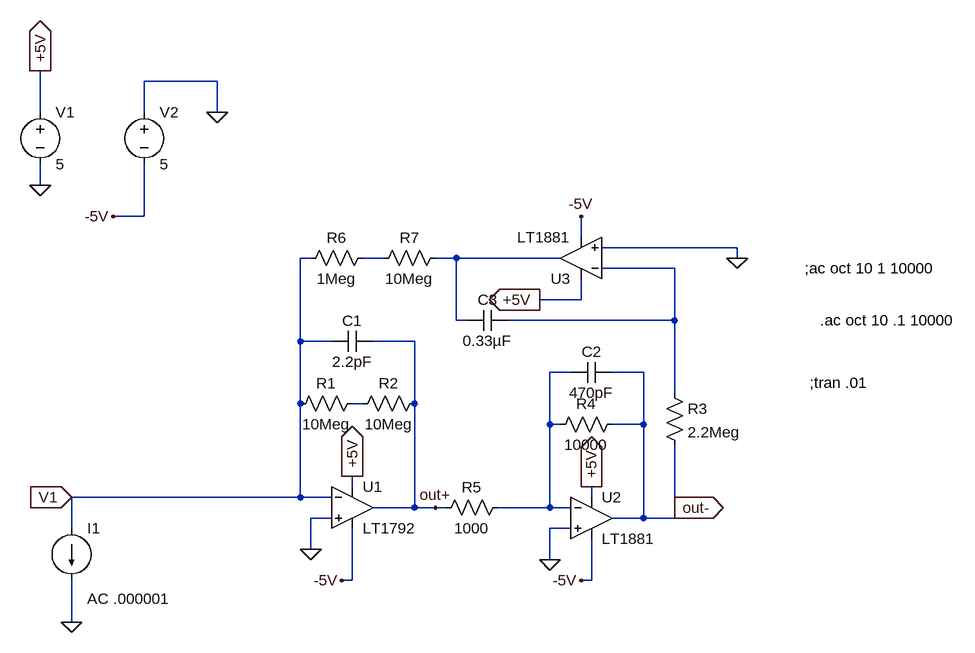
[diagram p0: schematic TRANSIMPDANCE AMPLIFIER WITH 60HZ SERVO REJECTION CIRCUIT.asc]
TRANSIMPDANCE AMPLIFIER WITH 60HZ SERVO REJECTION CIRCUIT.asc, the LTspice schematic file:
Version 4
SHEET 1 1128 680
WIRE -256 -368 -368 -368
WIRE -528 -320 -528 -384
WIRE -368 -320 -368 -368
WIRE -256 -320 -256 -368
WIRE -528 -208 -528 -240
WIRE -368 -160 -368 -240
WIRE -368 -160 -416 -160
WIRE 304 -128 304 -160
WIRE 544 -112 336 -112
WIRE -112 -96 -128 -96
WIRE 0 -96 -32 -96
WIRE 112 -96 80 -96
WIRE 272 -96 112 -96
WIRE 544 -96 544 -112
WIRE 448 -80 336 -80
WIRE 304 -32 304 -64
WIRE 304 -32 240 -32
WIRE 112 0 112 -96
WIRE 128 0 112 0
WIRE 448 0 448 -80
WIRE 448 0 192 0
WIRE -128 32 -128 -96
WIRE -80 32 -128 32
WIRE 48 32 -16 32
WIRE 288 80 256 80
WIRE 400 80 352 80
WIRE 448 112 448 0
WIRE -128 128 -128 32
WIRE -32 128 -48 128
WIRE 48 128 48 32
WIRE 256 160 256 80
WIRE 272 160 256 160
WIRE 400 160 400 80
WIRE 400 160 352 160
WIRE -48 256 -48 240
WIRE -128 272 -128 128
WIRE -128 272 -480 272
WIRE -80 272 -128 272
WIRE 320 272 320 256
WIRE 48 288 48 128
WIRE 48 288 -16 288
WIRE 80 288 48 288
WIRE 96 288 80 288
WIRE 256 288 256 160
WIRE 256 288 176 288
WIRE 288 288 256 288
WIRE 448 288 448 192
WIRE -80 304 -112 304
WIRE 400 304 400 160
WIRE 400 304 352 304
WIRE 448 304 448 288
WIRE 448 304 400 304
WIRE -480 320 -480 272
WIRE 288 320 256 320
WIRE -112 352 -112 304
WIRE -112 352 -128 352
WIRE 256 368 256 320
WIRE -48 400 -48 320
WIRE -48 400 -64 400
WIRE 320 400 320 336
WIRE 320 400 304 400
WIRE -480 464 -480 400
FLAG 544 -96 0
FLAG -112 352 0
FLAG 256 368 0
FLAG -256 -320 0
FLAG -528 -208 0
FLAG -528 -384 +5V
IOPIN -528 -384 Out
FLAG -48 240 +5V
IOPIN -48 240 Out
FLAG 320 256 +5V
IOPIN 320 256 Out
FLAG 240 -32 +5V
IOPIN 240 -32 Out
FLAG -416 -160 -5V
FLAG -64 400 -5V
FLAG 304 400 -5V
FLAG 304 -160 -5V
FLAG -480 464 0
FLAG -480 272 V1
IOPIN -480 272 In
FLAG 80 288 out+
FLAG 448 288 out-
IOPIN 448 288 Out
SYMBOL Opamps\\LT1792 -48 224 R0
SYMATTR InstName U1
SYMBOL Opamps\\LT1881 320 240 R0
SYMATTR InstName U2
SYMBOL Opamps\\LT1881 304 -32 R180
SYMATTR InstName U3
SYMBOL res -32 112 R90
WINDOW 0 0 56 VBottom 2
WINDOW 3 32 56 VTop 2
SYMATTR InstName R1
SYMATTR Value 10Meg
SYMBOL res 64 112 R90
WINDOW 0 0 56 VBottom 2
WINDOW 3 32 56 VTop 2
SYMATTR InstName R2
SYMATTR Value 10Meg
SYMBOL res 432 96 R0
SYMATTR InstName R3
SYMATTR Value 2.2Meg
SYMBOL res 368 144 R90
WINDOW 0 0 56 VBottom 2
WINDOW 3 32 56 VTop 2
SYMATTR InstName R4
SYMATTR Value 10000
SYMBOL res 192 272 R90
WINDOW 0 0 56 VBottom 2
WINDOW 3 32 56 VTop 2
SYMATTR InstName R5
SYMATTR Value 1000
SYMBOL res -16 -112 R90
WINDOW 0 0 56 VBottom 2
WINDOW 3 32 56 VTop 2
SYMATTR InstName R6
SYMATTR Value 1Meg
SYMATTR SpiceLine tol=1 pwr=0.1
SYMBOL res 96 -112 R90
WINDOW 0 0 56 VBottom 2
WINDOW 3 32 56 VTop 2
SYMATTR InstName R7
SYMATTR Value 10Meg
SYMBOL cap -16 16 R90
WINDOW 0 0 32 VBottom 2
WINDOW 3 32 32 VTop 2
SYMATTR InstName C1
SYMATTR Value 2.2pF
SYMBOL voltage -528 -336 R0
WINDOW 123 0 0 Left 2
WINDOW 39 0 0 Left 2
SYMATTR InstName V1
SYMATTR Value 5
SYMBOL voltage -368 -336 R0
WINDOW 123 0 0 Left 2
WINDOW 39 0 0 Left 2
SYMATTR InstName V2
SYMATTR Value 5
SYMBOL current -480 320 R0
WINDOW 123 24 108 Left 2
WINDOW 39 0 0 Left 2
SYMATTR Value2 AC .000001
SYMATTR InstName I1
SYMATTR Value ""
SYMBOL cap 192 -16 R90
WINDOW 0 0 32 VBottom 2
WINDOW 3 32 32 VTop 2
SYMATTR InstName C3
SYMATTR Value 0.33µF
SYMBOL cap 352 64 R90
WINDOW 0 0 32 VBottom 2
WINDOW 3 32 32 VTop 2
SYMATTR InstName C2
SYMATTR Value 470pF
TEXT 656 96 Left 2 !;tran .01
TEXT 672 0 Left 2 !.ac oct 10 .1 10000
TEXT 648 -80 Left 2 !;ac oct 10 1 10000

The netlist it stands for:
* TRANSIMPDANCE AMPLIFIER WITH 60HZ SERVO REJECTION CIRCUIT.asc
XU1 0 V1 +5V -5V out+ LT1792  ; pins In+ In- V+ V- OUT
XU2 0 N004 +5V -5V out- LT1881  ; pins In+ In- V+ V- OUT
XU3 0 N003 +5V -5V N002 LT1881  ; pins In+ In- V+ V- OUT
R1 N005 V1 10Meg
R2 out+ N005 10Meg
R3 N003 out- 2.2Meg
R4 out- N004 10000
R5 N004 out+ 1000
R6 N001 V1 1Meg tol=1 pwr=0.1
R7 N002 N001 10Meg
C1 out+ V1 2.2pF
V1 +5V 0 5
V2 0 -5V 5
I1 V1 0 AC .000001
C3 N003 N002 0.33µF
C2 out- N004 470pF
;tran .01
.ac oct 10 .1 10000
;ac oct 10 1 10000
.backanno
.end